# Altium schematic sheet FARM1T22.SchDoc
size A3
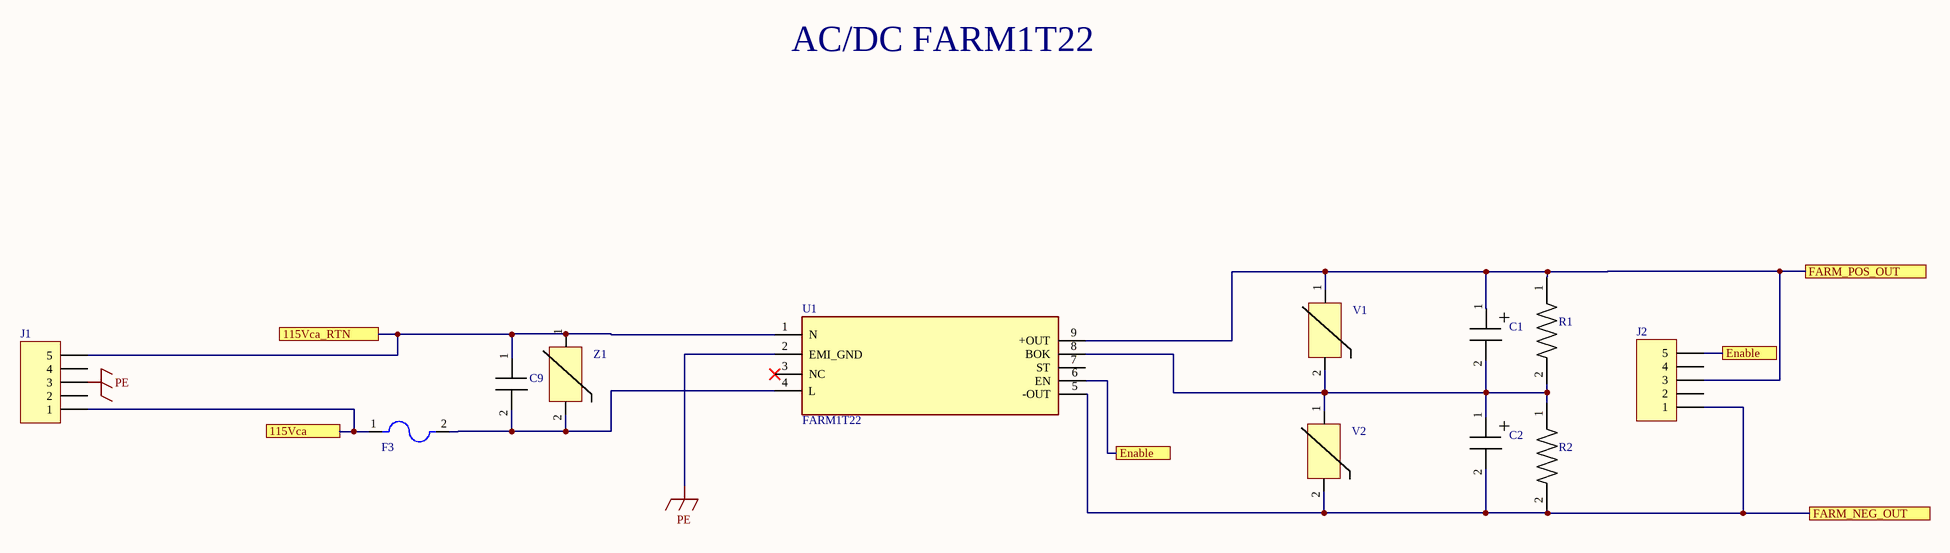
[diagram p0: FARM1T22.SchDoc]

## Parts
C1  EKXJ201ELL121MJ40S  [Chemicon elect cap]  (value not drawn)
C2  EKXJ201ELL121MJ40S  [Chemicon elect cap]  (value not drawn)
C9  ECQ-UAAF474T1  [ECQ-UAAF474T1]  (value not drawn)
F3  0678H9100-02  [Bel Fuse]  (value not drawn)
J1  Header 5  [HDR1X5]  (value not drawn)
J2  Header 5  [HDR1X5]  (value not drawn)
R1  RCS1206150KFKEA  [Vishay Resistor 1206]  (value not drawn)
R2  RCS1206150KFKEA  [Vishay Resistor 1206]  (value not drawn)
U1  FARM1T22  [FARM1]
V1  ERZV10D221  [MOV Panasonic]  (value not drawn)
V2  ERZV10D221  [MOV Panasonic]  (value not drawn)
Z1  MOV-10D471KTR  [MOV-10D471KTR]  (value not drawn)

## Ports
115Vca, 115Vca_RTN, Enable, FARM_NEG_OUT, FARM_POS_OUT

## Nets
PE: J1.3 U1.2(EMI_GND)
115Vca: F3.1 J1.1 ; port 115Vca
115Vca_RTN: C9.1 J1.5 U1.1(N) Z1.1 ; port 115Vca_RTN
Enable: J2.5 U1.6(EN) ; port Enable
FARM_NEG_OUT: C2.2 J2.1 R2.2 U1.5(-OUT) V2.2 ; port FARM_NEG_OUT
FARM_POS_OUT: C1.1 J2.3 R1.1 U1.9(+OUT) V1.1 ; port FARM_POS_OUT
NetC1_2: C1.2 C2.1 R1.2 R2.1 U1.8(BOK) V1.2 V2.1
NetC9_2: C9.2 F3.2 U1.4(L) Z1.2

Not connected (* = marked no-connect by the designer): J1 2 4; J2 2 4; U1 3(NC)* 7(ST)

## Notes on the sheet
- AC/DC FARM1T22
- (in symbol EKXJ201ELL121MJ40S) +

## Library data of the parts
C1 C2 = EKXJ201ELL121MJ40S: Condensadores electrolíticos de aluminio (con terminales radiales) 120uF 200Volts; ComponentLink1Description: EKXJ201ELL121MJ40S; ComponentLink1URL: https://www.mouser.es/ProductDetail/United-Chemi-Con/EKXJ201ELL121MJ40S?qs=RpYEFuZ7GTiczXQxYsnqXQ%3D%3D
C9 = Panasonic Safety Film Cap: Condensadores de seguridad 275VAC 0.47uF 10% L/S=22.5mm AEC-Q200; ComponentLink1Description: ECQ-UAAF474T1; ComponentLink1URL: https://www.mouser.es/ProductDetail/Panasonic/ECQ-UAAF474T1?qs=byeeYqUIh0OjVBR1dvCIcA%3D%3D
F3 = Bel Fuse: Fusibles de montaje en superficie 3925 Surface Mt Fuse 10A; ComponentLink1Description: 0678H9100-02; ComponentLink1URL: https://www.mouser.es/ProductDetail/Bel-Fuse/0678H9100-02?qs=sGAEpiMZZMsIz3CjQ1xegQaWavv5npkeqjhkdzw46zcL4ULcSDYduw%3D%3D
J1 J2 = Header 5: Header, 5-Pin; LatestRevisionDate: 17-Jul-2002; LatestRevisionNote: Re-released for DXP Platform.; Publisher: Altium Limited
R1 R2 = Vishay: SMD 0.5watt 150Kohms 1%; ComponentLink1Description: RCS1206150KFKEA; ComponentLink1URL: https://www.mouser.es/ProductDetail/Vishay-Dale/RCS1206150KFKEA?qs=sGAEpiMZZMtlubZbdhIBIAh%252BOLxU8fCrFpMos3Ns0tQ%3D
U1 = FARM1: AC front end module which provides EMI filtering, autoranging line rectification / and inrush current limiting; ComponentLink1Description: FARM1T22; ComponentLink1URL: https://www.mouser.es/ProductDetail/Vicor/FARM1T22?qs=%2Fha2pyFadui0ZjEYzWnct3R1NhUFpdHSrcMcwrYbnvc%3D; ComponentLink2Description: Datasheet; ComponentLink2URL: https://www.mouser.es/datasheet/2/685/ds_farm-934562.pdf
V1 V2 = MOV ERZ Panasonic: Varistores 220V 25A CLAMP; ComponentLink1Description: ERZV10D221; ComponentLink1URL: https://industrial.panasonic.com/ww/products/emc-circuit-protection/circuit-protection/surge-components/models/ERZV10D221
Z1 = MOV-10D471KTR: 470V 2.5kA Varistor 1 Circuit Through Hole Disc 10mm